# EAGLE design Arduino (EAGLE 9.6.2)
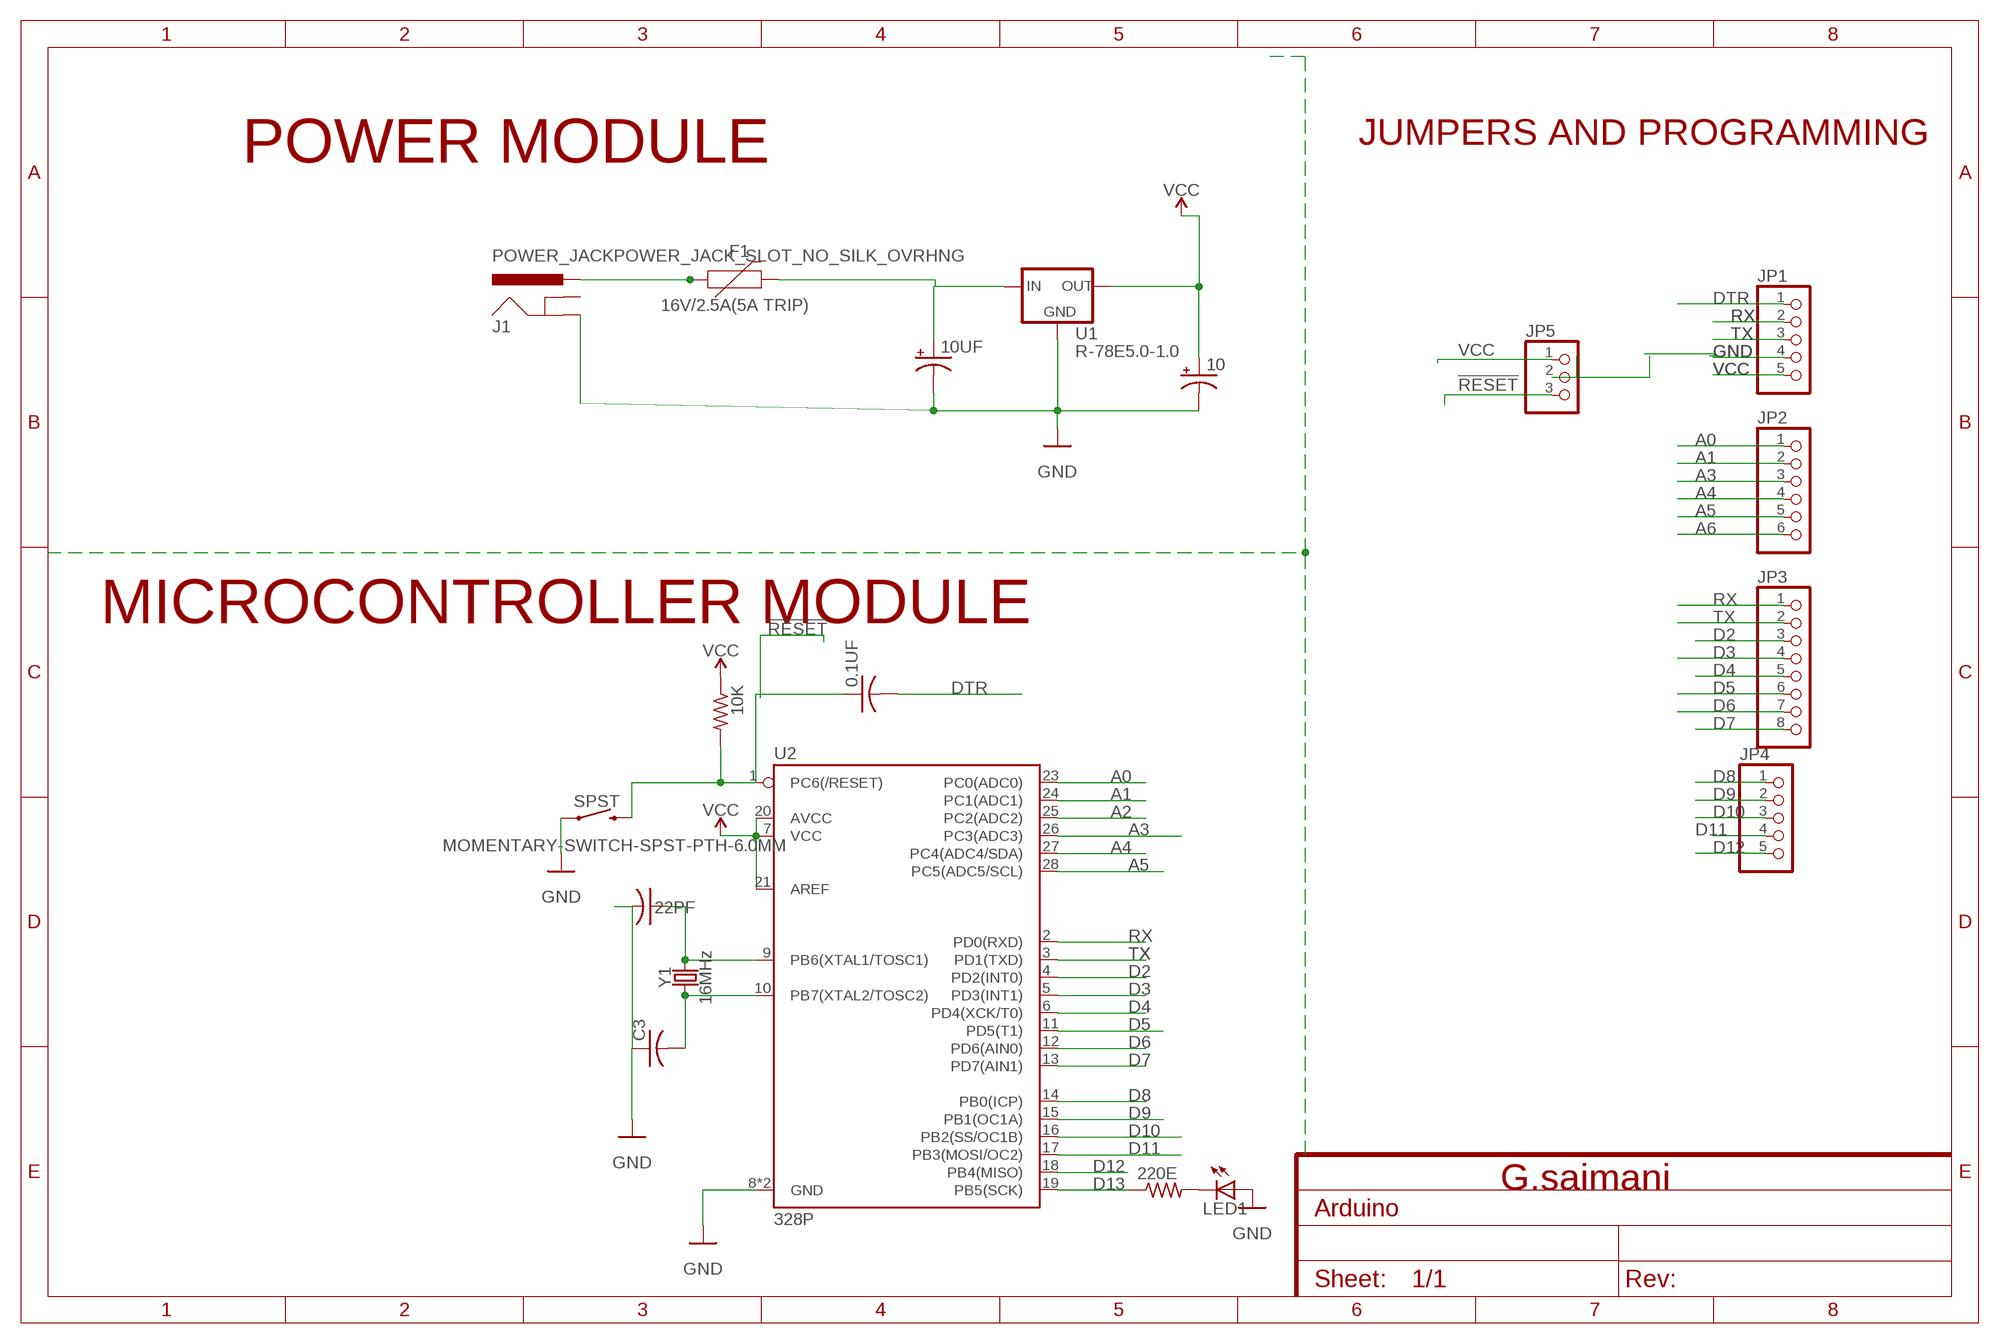
[diagram p0: schematic, sheet 1]

## Parts
0.1UF  C-US025-024X044  [C025-024X044]
10  CPOL-USE2-5  [E2-5]
10K  R-US_0204/7  [0204/7]
10UF  CPOL-USE2-5  [E2-5]
22PF  C-US025-024X044  [C025-024X044]
220E  R-US_0207/7  [0207/7]
C3  C-US025-024X044  [C025-024X044]
F1  16V/2.5A(5A TRIP)  PPTC_16V_2.5A  [1812]
J1  POWER_JACKPOWER_JACK_SLOT_NO_SILK_OVRHNG  [POWER_JACK_PTH_SLOT_NO_OVRHNG_SILK]
JP1  PINHD-1X5  [1X05]
JP2  PINHD-1X6  [1X06]
JP3  PINHD-1X8  [1X08]
JP4  PINHD-1X5  [1X05]
JP5  PINHD-1X3  [1X03]
LED1  LED  [SMARTLED-TTW]
SPST  MOMENTARY-SWITCH-SPST-PTH-6.0MM  [TACTILE_SWITCH_PTH_6.0MM]
U1  R-78E5.0-1.0  [DC-DC_CONVERTER_78XX]
U2  328P  ATMEGA328P_PDIP  [DIP28]
Y1  16MHz  CRYSTAL-16MHZPTH-HC49US  [HC49US]

## Nets
!RESET: JP5.3
A0: JP2.1 U2.23(PC0(ADC0))
A1: JP2.2 U2.24(PC1(ADC1))
A2: U2.25(PC2(ADC2))
A3: JP2.3 U2.26(PC3(ADC3))
A4: JP2.4 U2.27(PC4(ADC4/SDA))
A5: JP2.5 U2.28(PC5(ADC5/SCL))
A6: JP2.6
D2: JP3.3 U2.4(PD2(INT0))
D3: JP3.4 U2.5(PD3(INT1))
D4: JP3.5 U2.6(PD4(XCK/T0))
D5: JP3.6 U2.11(PD5(T1))
D6: JP3.7 U2.12(PD6(AIN0))
D7: JP3.8 U2.13(PD7(AIN1))
D8: JP4.1 U2.14(PB0(ICP))
D9: JP4.2 U2.15(PB1(OC1A))
D10: JP4.3 U2.16(PB2(SS/OC1B))
D11: JP4.4 U2.17(PB3(MOSI/OC2))
D12: JP4.5 U2.18(PB4(MISO))
D13: 220E.1 U2.19(PB5(SCK))
DTR: 0.1UF.2 JP1.1
GND: 10.- 10UF.- 22PF.2 C3.1 J1.GND JP1.4 LED1.A@1(A) SPST.1 U1.GND U2.8(GND) U2.22(GND)
N$1: 10UF.+ U1.VIN(IN)
N$2: 22PF.1 U2.9(PB6(XTAL1/TOSC1)) Y1.2
N$3: C3.2 U2.10(PB7(XTAL2/TOSC2)) Y1.1
N$4: 0.1UF.1 10K.2 SPST.3 U2.1(PC6(/RESET))
N$5: 220E.2 LED1.C@1(C)
N$7: F1.1 J1.PWR
N$8: F1.2
N$11: JP5.2
RX: JP1.2 JP3.1 U2.2(PD0(RXD))
TX: JP1.3 JP3.2 U2.3(PD1(TXD))
VCC: 10.+ 10K.1 JP1.5 JP5.1 U1.VOUT(OUT) U2.7(VCC) U2.20(AVCC) U2.21(AREF)
Unconnected: J1.GNDBREAK

## Notes on the sheet
- JUMPERS AND PROGRAMMING
- POWER MODULE
- MICROCONTROLLER MODULE
- G.saimani

## Library data of the parts
0.1UF 22PF C3 = rcl:C-US: CAPACITOR, American symbol; SPICEPREFIX: C
10 10UF = rcl:CPOL-US: POLARIZED CAPACITOR, American symbol; SPICEPREFIX: C
10K 220E = rcl:R-US_: RESISTOR, American symbol; SPICEPREFIX: R
F1 = SparkFun-Fuses:PPTC: Resettable Fuse PPTC Resettable Fuse. Really a sort of resistor with a polymeric positive temperature coefficient whose resistance increases dramatically with an increase in temperature. When heated by the power passing through the resistance rises causing the current to be limited, protecting the circuit. This is achieved by the transition of the polymer from a crystalline to an amorphous state where the conductive carbon separates breaking the conductive pathways found in the cool crystalline structure. When a PPTC cools back down it resumes conducting letting the circuit turn back on. SparkFun Products: SparkFun RedBoard - Programmed with Arduino <https://www.sparkfun.com/products/12757> Pro Micro - 5V/16MHz <https://www.sparkfun.com/products/12640> Arduino Pro 328 - 5V/16MHz <https://www.sparkfun.com/products/10915> MP3 Trigger <https://www.sparkfun.com/products/13720>; PROD_ID: RES-14390
J1 = SparkFun-Connectors:POWER_JACK: Power Jack Connector This is the standard 5.5mm barrel jack for power. The PTH is the most common, proven, reliable, footprint. The Slot footprint only works if the mill layer is transmitted to the PCB fab house so be warned. Here are the connectors we sell at SparkFun: DC Barrel Power Jack/Connector <https://www.sparkfun.com/products/119> (PRT-00119) DC Barrel Power Jack/Connector (SMD) <https://www.sparkfun.com/products/12748> (PRT-12748) DC Barrel Jack Adapter - Breadboard Compatible <https://www.sparkfun.com/products/10811> (PRT-10811) It is used on this SparkFun product (and many, many others): SparkFun RedBoard - Programmed with Arduino <https://www.sparkfun.com/products/12757> (DEV-12757) Also, if you need a mating power supply or connector, please check these out: Wall Adapter Power Supply - 9VDC 650mA <https://www.sparkfun.com/products/298> (TOL-00298) DC Barrel Jack Adapter - Male <https://www.sparkfun.com/products/10287> (PRT-10287)
JP1 JP4 = pinhead:PINHD-1X5: PIN HEADER
JP2 = pinhead:PINHD-1X6: PIN HEADER
JP3 = pinhead:PINHD-1X8: PIN HEADER
JP5 = pinhead:PINHD-1X3: PIN HEADER
LED1 = adafruit:LED: LED OSRAM: - CHIPLED LG R971, LG N971, LY N971, LG Q971, LY Q971, LO R971, LY R971 LH N974, LH R974 LS Q976, LO Q976, LY Q976 LO Q996 - Hyper CHIPLED LW Q18S LB Q993, LB Q99A, LB R99A - SideLED LS A670, LO A670, LY A670, LG A670, LP A670 LB A673, LV A673, LT A673, LW A673 LH A674 LY A675 LS A676, LA A676, LO A676, LY A676, LW A676 LS A679, LY A679, LG A679 - Hyper Micro SIDELED® LS Y876, LA Y876, LO Y876, LY Y876 LT Y87S - SmartLED LW L88C, LW L88S LB L89C, LB L89S, LG L890 LS L89K, LO L89K, LY L89K LS L896, LA L896, LO L896, LY L896 - TOPLED LS T670, LO T670, LY T670, LG T670, LP T670 LSG T670, LSP T670, LSY T670, LOP T670, LYG T670 LG T671, LOG T671, LSG T671 LB T673, LV T673, LT T673, LW T673 LH T674 LS T676, LA T676, LO T676, LY T676, LB T676, LH T676, LSB T676, LW T676 LB T67C, LV T67C, LT T67C, LS T67K, LO T67K, LY T67K, LW E67C LS E67B, LA E67B, LO E67B, LY E67B, LB E67C, LV E67C, LT E67C LW T67C LS T679, LY T679, LG T679 LS T770, LO T770, LY T770, LG T770, LP T770 LB T773, LV T773, LT T773, LW T773 LH T774 LS E675, LA E675, LY E675, LS T675 LS T776, LA T776, LO T776, LY T776, LB T776 LHGB T686 LT T68C, LB T68C - Hyper Mini TOPLED® LB M676 - Mini TOPLED Santana® LG M470 LS M47K, LO M47K, LY M47K Source: http://www.osram.convergy.de/
SPST = SparkFun-Switches:MOMENTARY-SWITCH-SPST: Momentary Switch (Pushbutton) - SPST Normally-open (NO) SPST momentary switches (buttons, pushbuttons). Variants PTH-12MM - 12mm square, through-hole Momentary Pushbutton Switch - 12mm Square <https://www.sparkfun.com/products/9190> (COM-09190) PTH-6.0MM, PTH-6.0MM-KIT - 6.0mm square, through-hole Mini Pushbutton Switch <https://www.sparkfun.com/products/97> (COM-00097) KIT package intended for soldering kit's - only one side of pads' copper is exposed. PTH-RIGHT-ANGLE-KIT - Right-angle, through-hole Right Angle Tactile Button <https://www.sparkfun.com/products/10791> - Used on SparkFun BigTime Watch Kit <https://www.sparkfun.com/products/11734> SMD-12MM - 12mm square, surface-mount Tactile Button - SMD (12mm) <https://www.sparkfun.com/products/12993> (COM-12993) Used on SparkFun PicoBoard <https://www.sparkfun.com/products/11888> SMD-4.5MM - 4.5mm Square Trackball Switch Used on SparkFun Blackberry Trackballer Breakout <https://www.sparkfun.com/products/13169> SMD-4.6MMX2.8MM - 4.60mm x 2.80mm, surface mount Used on SparkFun Pro Micro - RP2040 <https://www.sparkfun.com/products/17717> SMD-5.2MM, SMD-5.2-REDUNDANT - 5.2mm square, surface-mount Mini Pushbutton Switch - SMD <https://www.sparkfun.com/products/8720> (COM-08720) Used on Arduino Pro Mini <https://www.sparkfun.com/products/11114> REDUNDANT package connects both switch circuits together SMD-6.0X3.5MM - 6.0 x 3.5mm, surface mount Momentary Reset Switch SMD <https://www.sparkfun.com/products/8229> (COM-08229) SMD-6.2MM-TALL - 6.2mm square, surface mount Tactile Button - SMD (6mm) <https://www.sparkfun.com/products/12992> Used on SparkFun Digital Sandbox <https://www.sparkfun.com/products/12651> SMD-RIGHT-ANGLE - Right-angle, surface mount Used on SparkFun Block for Intel® Edison - Arduino <https://www.sparkfun.com/products/13036>; PROD_ID: SWCH-08441; SF_SKU: COM-00097
U1 = SparkFun-IC-Power:R-78E5.0-1.0: Recom Power 5V 1A DC/DC Converter The Recom R-78E5.0-X.X is a compact DC/DC converter module that is a pin for pin drop-in replacement for the LM7805 linear voltage regulator. Specifications: Input Range: 7-28V Output Voltage: 5V Output Current: 1A Max Efficiency: 91% Datasheet <https://www.recom-power.com/pdf/Innoline/R-78Exx-1.0.pdf>; PROD_ID: COM-13655
U2 = SparkFun-IC-Microcontroller:ATMEGA328P_PDIP: Atmel 328P Through hole ATMEGA328P uC used in the Arduino 32kb flash, 1k EEPROM, 2k SRAM Datasheet <http://www.sparkfun.com/datasheets/Components/SMD/ATMega328.pdf> SparkFun Products Storefront component: AVR 28 Pin 20MHz 32K 6A/D - ATMega328P <https://www.sparkfun.com/products/9061> (COM-09061) SparkFun Simon Says - Through-Hole Soldering Kit <https://www.sparkfun.com/products/10547> (KIT-10547) SparkFun Learn to Solder - Simon Says <https://www.sparkfun.com/products/13708> (KIT-13708) SparkFun BigTime Watch Kit <https://www.sparkfun.com/products/11734> (KIT-11734) SparkFun ClockIt <https://www.sparkfun.com/products/10930> (KIT-10930) SparkFun Serial Enabled LCD Kit <https://www.sparkfun.com/products/10097> (LCD-10097) SparkFun Simon Tilts - Through Hole Soldering Kit <https://www.sparkfun.com/products/12634> (KIT-12634) SparkFun Frequency Counter Kit <https://www.sparkfun.com/products/10140> (KIT-10140) FabFM Radio Kit <https://www.sparkfun.com/products/11043> (KIT-11043) SparkFun Binary Blaster Kit <https://www.sparkfun.com/products/12037> (KIT-12037) SparkFun Metro-Gnome <https://www.sparkfun.com/products/9236> (KIT-09236) ATmega328 with Arduino Optiboot (Uno) <https://www.sparkfun.com/products/10524> (DEV-10524); PROD_ID: IC-09136
Y1 = SparkFun-Clocks:CRYSTAL-16MHZ: 16MHz Crystal Digikey Example <http://www.digikey.com/product-search/en?keywords=535-9122-1-ND> Frequency: 16MHz Frequency Stability: ±50ppm Frequency Tolerance: ±20ppm Load Capacitance: 18pF SparkFun Products: Pro Micro -5V/16MHz <https://www.sparkfun.com/products/12640> SparkFun Serial Enabled LCD Kit <https://www.sparkfun.com/products/10097>; PROD_ID: XTAL-08181; SF_ID: COM-00536

## Board
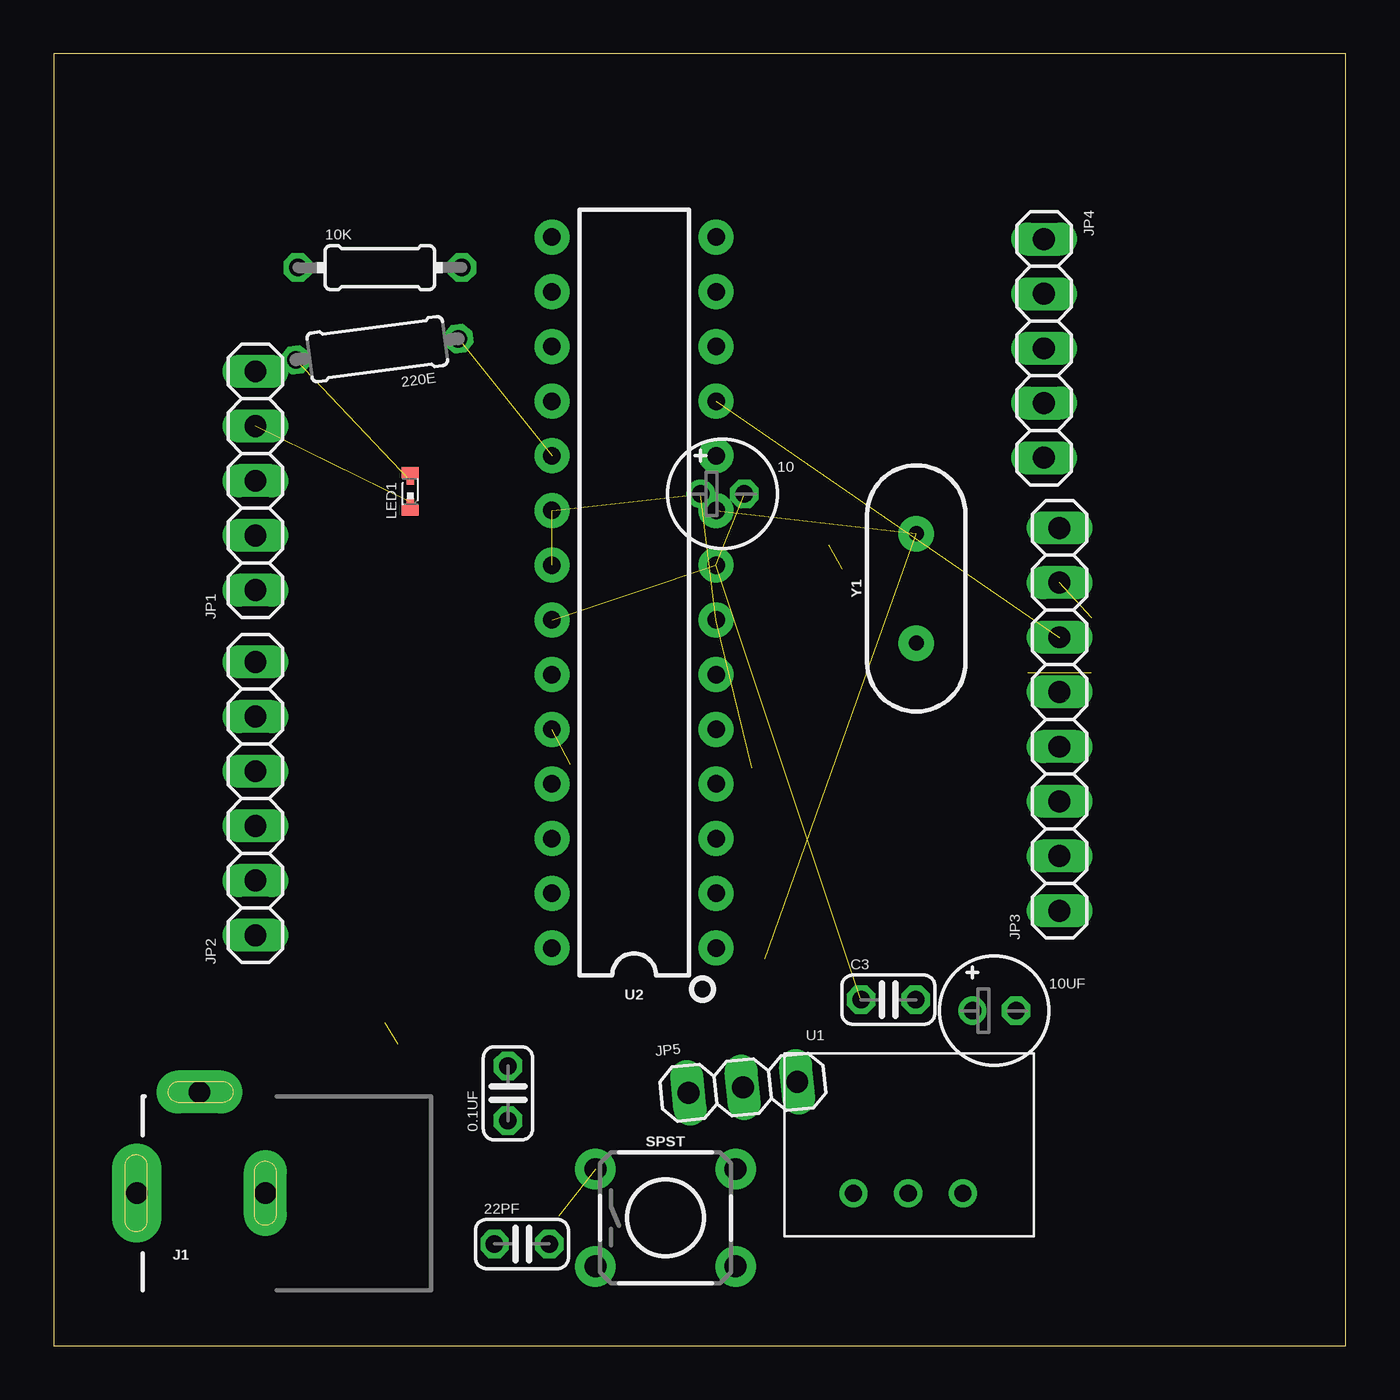
[diagram p1: board, top side]
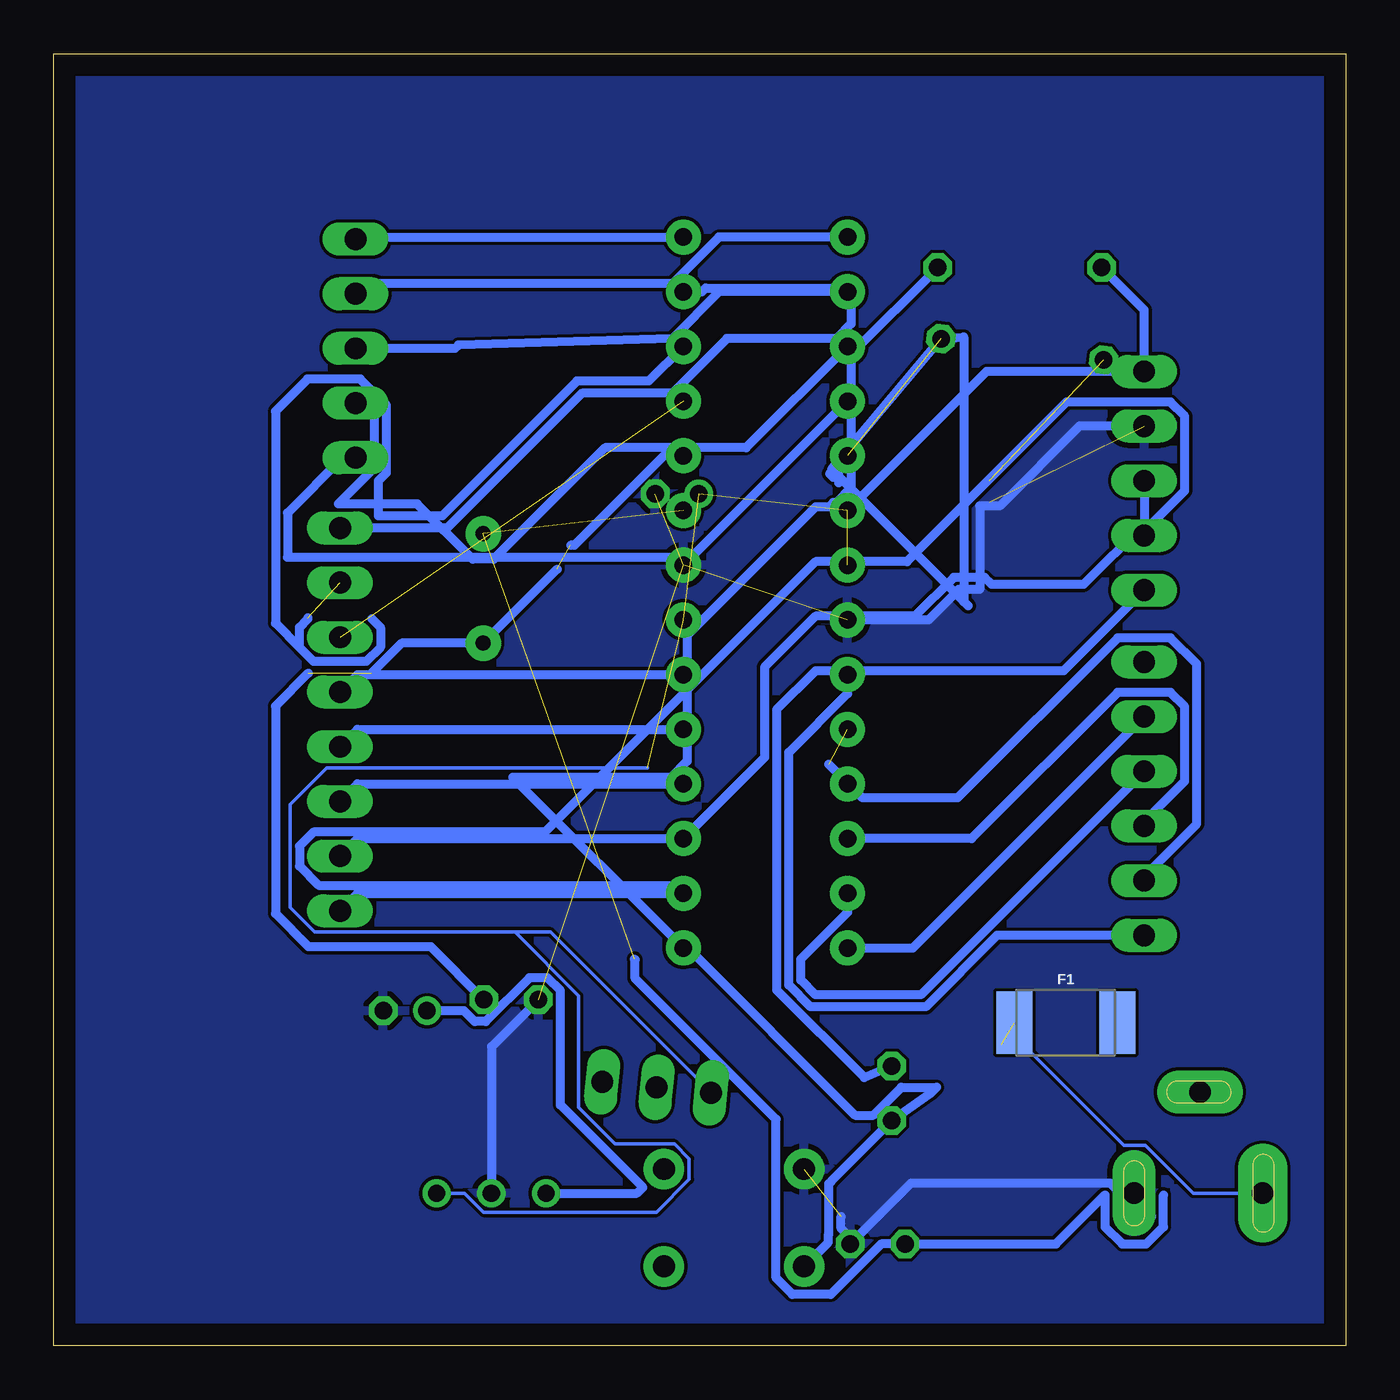
[diagram p2: board, bottom side, seen from below]

Size 60 x 60 mm. Coordinates in mm from the lower left corner, seen from the top.
Outline: 0,0 60,0 60,60 0,60 0,0
Copper layers (1*16): Top 0.035mm / dielectric 1.5mm / Bottom 0.035mm
Design rules "default": minimum track width 6mil, minimum drill 0.35mm, track to track 6mil, track to pad 6mil, pad to pad 6mil, via to via 6mil, smd to smd 6mil, copper to edge 40mil, drill to drill 6mil, minimum pad ring 10mil, minimum via ring 8mil, stop-mask expansion 4mil, vias tented up to drill 0mil, thermal gap 10mil

### Footprints (pad centres in the part's own frame; a part is rotated, then mirrored left to right if it is on the bottom)
C025-024X044 = drill 0.813 octagon: 1 -1.27,0; 2 1.27,0
E2-5 = drill 0.813 pad 1.27: + -1.016,0 | drill 0.813 pad 1.27 octagon: - 1.016,0
0204/7 = drill 0.813 octagon: 1 -3.81,0; 2 3.81,0
0207/7 = drill 0.813 octagon: 1 -3.81,0; 2 3.81,0
1812 = smd 1.676 x 2.896: 1 -2.388,0; 2 2.388,0
POWER_JACK_PTH_SLOT_NO_OVRHNG_SILK = drill 1 pad 2 long: GND 0,0; GNDBREAK -3.048,4.699 | drill 1 pad 2.3 long: PWR -5.969,0
1X05 = drill 1.016 long: 1 -5.08,0; 2 -2.54,0; 3 0,0; 4 2.54,0; 5 5.08,0
1X06 = drill 1.016 long: 1 -6.35,0; 2 -3.81,0; 3 -1.27,0; 4 1.27,0; 5 3.81,0; 6 6.35,0
1X08 = drill 1.016 long: 1 -8.89,0; 2 -6.35,0; 3 -3.81,0; 4 -1.27,0; 5 1.27,0; 6 3.81,0; 7 6.35,0; 8 8.89,0
1X03 = drill 1.016 long: 1 -2.54,0; 2 0,0; 3 2.54,0
SMARTLED-TTW = smd 0.8 x 0.5: A 0,-0.875; C 0,0.875 | smd 0.35 x 0.35: A@1 0,-0.5; C@1 0,0.5
TACTILE_SWITCH_PTH_6.0MM = drill 1.016 pad 1.88: 1 -3.251,2.261; 2 3.251,2.261; 3 -3.251,-2.261; 4 3.251,-2.261
DC-DC_CONVERTER_78XX = drill 0.8: GND 0,0; VIN -2.54,0; VOUT 2.54,0
DIP28 = drill 0.813 pad 1.626: 1 -16.51,-3.81; 2 -13.97,-3.81; 3 -11.43,-3.81; 4 -8.89,-3.81; 5 -6.35,-3.81; 6 -3.81,-3.81; 7 -1.27,-3.81; 8 1.27,-3.81; 9 3.81,-3.81; 10 6.35,-3.81; 11 8.89,-3.81; 12 11.43,-3.81; 13 13.97,-3.81; 14 16.51,-3.81; 15 16.51,3.81; 16 13.97,3.81; 17 11.43,3.81; 18 8.89,3.81; 19 6.35,3.81; 20 3.81,3.81; 21 1.27,3.81; 22 -1.27,3.81; 23 -3.81,3.81; 24 -6.35,3.81; 25 -8.89,3.81; 26 -11.43,3.81; 27 -13.97,3.81; 28 -16.51,3.81
HC49US = drill 0.7 pad 1.651: 1 -2.54,0; 2 2.54,0

### Placement (x,y rotation side)
0.1UF  21.09,11.72 90 top
10  31.06,39.56 0 top
10K  15.14,50.07 0 top
10UF  43.68,15.56 0 top
22PF  21.74,4.72 0 top
220E  15.02,46.28 187.4 top
C3  38.76,16.07 0 top
F1  13,15 0 bottom
J1  9.82,7.08 0 top
JP1  9.36,40.17 90 top
JP2  9.36,25.41 90 top
JP3  46.71,29.09 90 top
JP4  45.99,46.32 270 top
JP5  32,12 5.7 top
LED1  16.55,39.67 0 top
SPST  28.41,5.94 0 top
U1  39.68,7.08 0 top
U2  26.95,34.98 90 top
Y1  40.06,35.17 90 top

### Tracks (layer width: path | path; a pad name or v marks a point on that pad's centre or on a via)
A0
  Bottom 0.406: JP2.1 16.19,19.06 19.51,15.74 24.86,15.74 25.87,16.75 25.87,27.55 23.14,30.28 U2.23
A1  (1 unrouted)
  Bottom 0.406: 24,27 22.44,25.44 18.02,25.44 10.59,32.88 8.13,32.88 6.92,31.66 6.92,24.24 9.36,21.8 JP2.2
A3
  Bottom 0.406: U2.26 17.37,23.55 10.59,30.34 8.13,30.34 7.48,29.68 7.48,26.22 9.36,24.34 JP2.3
A4
  Bottom 0.406: JP2.4 19.74,16.3 24.62,16.3 25.31,16.99 25.31,17.95 23.14,20.12 U2.27
A5
  Bottom 0.406: U2.28 20.11,18.47 JP2.5
D2
  Bottom 0.406: JP3.3 45.9,26.09 U2.4
D3
  Bottom 0.406: JP3.4 45.9,28.63 U2.5
D4  (1 unrouted)
  Top 0.406: 46.83,30.17 47,30
  Bottom 0.406: U2.6 45.9,31.17 JP3.5 46.71,30.29 47,30
D5  (1 unrouted)
D6  (1 unrouted)
  Bottom 0.406: U2.12 32.37,44.8 35.7,44.8 41.96,38.54 44.93,38.54 44.93,40.17 44.55,40.55 44.55,43.68 45.77,44.9 48.22,44.9 49.71,43.41 49.71,33.55 48.59,32.44 | 48.59,32.44 47.94,31.78 45.48,31.78 44.83,32.44 44.83,33.36 45.23,33.76 | 48.59,32.44 48.59,33.36 48.2,33.75 48.2,33.8
D7
  Bottom 0.406: JP3.8 41.73,37.98 35.47,44.24 31.28,44.24 28.74,46.78 23.66,46.78 22.97,47.47 22.97,48.43 23.66,49.12 29.73,49.12 29.9,48.95 U2.13
D8
  Bottom 0.406: JP4.1 45.9,51.49 U2.14
D9
  Bottom 0.406: U2.15 29.11,51.49 31.28,49.32 45.53,49.32 JP4.2
D10
  Bottom 0.406: U2.16 29.11,48.95 31.28,46.78 41.21,46.48 41.37,46.32 JP4.3
D11
  Bottom 0.406: U2.17 27.85,41.7 34.4,41.7 39.57,36.53 40.55,36.53 43.12,39.1 46.79,39.1 45.11,40.78 45.11,43.78 JP4.4
D12
  Bottom 0.406: JP4.5 46.58,41.24 49.15,38.67 49.15,36.62 30.39,36.62 U2.18
D13  (1 unrouted)
  Bottom 0.406: 17.74,34.56 17.74,46.85 220E.1 23.88,40.71 17.53,34.35 | 23.54,40.07 23.54,40.93 U2.19 23.97,40.5 23.8,40.33
DTR
  Bottom 0.406: 0.1UF.2 22.36,12.46 26.43,16.52 26.43,29.54 24.62,31.34 13.11,31.34 JP1.1
GND  (5 unrouted)
  Bottom 0.406: U2.22 19.38,33.71 17.97,35.12 17,35.12 17,39 16.07,39 12.36,42.71 JP1.4 | C3.1 39.68,13.88 U1.GND | J1.GND 9.82,6.82 9.02,6.02 9.02,6 9.82,6.8 J1.GND | J1.GND 10.46,7.08 10.94,7.56 20.17,7.56 22PF.2 23,5 23.44,5.44 23.44,6
  pour Bottom: 0,0 60,0 60,60 0,60
N$1
  Bottom 0.406: U1.VIN 32.92,7.08 32.65,7.35 36.47,11.18 36.47,16.49 37.07,17.09 37.91,17.09 39.94,15.05 40.45,15.05 40.96,15.56 10UF.+
N$2  (2 unrouted)
  Bottom 0.406: 33.04,17.96 33,17.92 33,17.06 26.45,10.51 26.45,3.14 25.7,2.38 23.91,2.38 21.57,4.72 22PF.1 13.46,4.72 11.18,7 11.18,5.52 10.38,4.72 9.26,4.72 8.46,5.52 8.46,7
N$3  (2 unrouted)
  Bottom 0.406: U2.10 31.67,41.33 35.82,37.18 36,37.18 | C3.2 42.48,18.52 48.17,18.52 49.71,20.06 49.71,29.7 48.18,31.23 | 36.63,36.06 Y1.1 43.85,32.63 45.24,31.23
N$4
  Bottom 0.406: 10K.2 22.97,46.05 22.97,39.85 23.66,39.16 23.8,39.16 24,38.96 24.62,38.96 30.59,32.99 30.59,27.15 31.34,26.4 38.69,26.4 U2.1 30.55,18.47 22.78,10.7 21.94,10.7 20.64,12 19,12 19.28,11.72 0.1UF.1 23.86,7.68 23.86,7.66 24,7.53 24,5.17 24.03,5.14 24.03,4.81 SPST.3
N$5  (1 unrouted)
N$7  (1 unrouted)
  Bottom 0.152: J1.PWR 7.08,7.08 9.31,9.31 10.31,9.31 15,14 16,14 | F1.1 15,15
RX
  Bottom 0.406: JP3.1 45.9,21.01 U2.2 31.13,21.38 47.69,21.38 48.59,22.28 48.59,23.2 47.94,23.86 37.19,23.86 24.62,36.42 20.37,36.42 12.96,43.83 8.13,43.83 7.48,43.17 7.48,39.71 9.36,37.83 JP1.2
TX
  Bottom 0.406: JP3.2 45.9,23.55 U2.3 26.98,27.32 26.98,31.52 24.62,33.88 20,33.88 18.2,35.68 16.77,35.68 16.44,35.35 12.18,35.35 9.36,38.17 JP1.3
VCC  (4 unrouted)
  Bottom 0.152: 38.58,19.21 47.88,19.21 49.02,20.35 49.02,25.13 47.32,26.83 32.43,26.83 | U1.VOUT 40.93,7.08 40.05,6.2 32.01,6.2 30.49,7.72 30.49,8.69 31.18,9.37 33.93,9.37 35.63,11.07 35.63,16.26 38.58,19.21 | 38.58,19.21 36.92,19.21 JP5.1
  Bottom 0.406: 10K.1 9.36,48.1 JP1.5 16.68,45.25 U2.20